# Altium schematic sheet 780-00055, rev1B, CPLD SCH, NRES RTD board.SchDoc
size B; PageSetup: Record=PageOptions|CenterHorizontal=True|CenterVertical=True|PrintScale=1.09|XCorrection=1.00|YCorrection=1.00|PrintKind=0|BorderSize=5000000|LeftOffset=0|BottomOffset=0|Orientation=2|PaperLength=1000|PaperWidth=1000|Scale=100|PaperSource=7|PrintQuality=-4|MediaType=1|DitherType=10|PaperKind=Ledger|PrintScaleMode=1
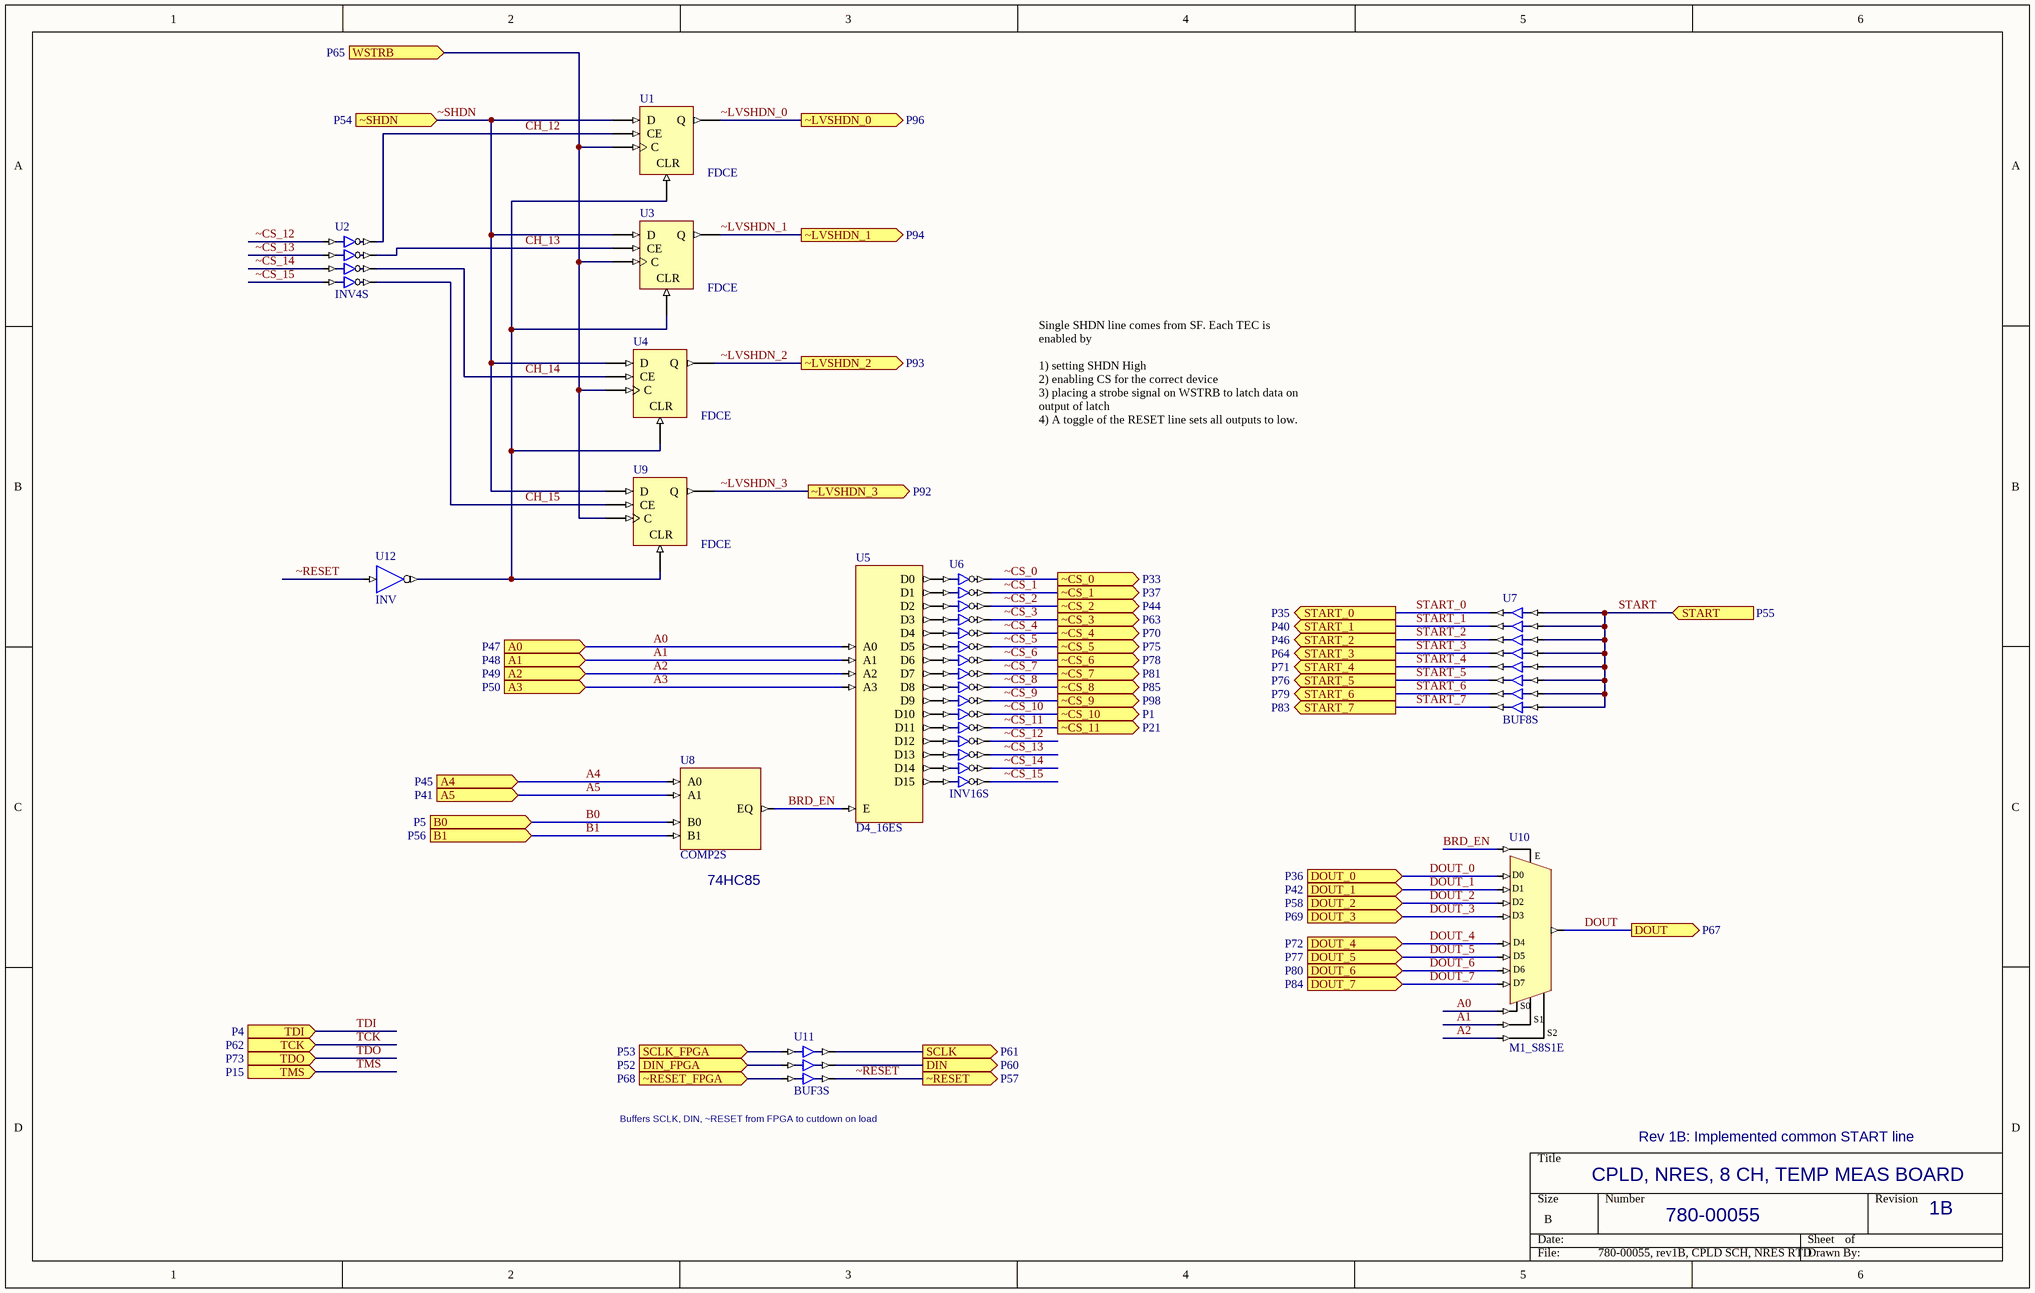
[diagram p0: 780-00055, rev1B, CPLD SCH, NRES RTD board.SchDoc]

## Parts
U1  FDCE
U2  INV4S
U3  FDCE
U4  FDCE
U5  D4_16ES
U6  INV16S
U7  BUF8S
U8  COMP2S
U9  FDCE
U10  M1_S8S1E
U11  BUF3S
U12  INV

## Ports
A0 (in, see P47), A1 (in, see P48), A2 (in, see P49), A3 (in, see P50), A4 (in, see P45), A5 (in, see P41), B0 (in, see P5), B1 (in, see P56), DIN (out, see P60), DIN_FPGA (in, see P52), DOUT (out, see P67), DOUT_0 (in, see P36), DOUT_1 (in, see P42), DOUT_2 (in, see P58), DOUT_3 (in, see P69), DOUT_4 (in, see P72), DOUT_5 (in, see P77), DOUT_6 (in, see P80), DOUT_7 (in, see P84), SCLK (out, see P61), SCLK_FPGA (in, see P53), START (in, see P55), START_0 (out, see P35), START_1 (out, see P40), START_2 (out, see P46), START_3 (out, see P64), START_4 (out, see P71), START_5 (out, see P76), START_6 (out, see P79), START_7 (out, see P83), TCK (in, see P62), TDI (in, see P4), TDO (in, see P73), TMS (in, see P15), WSTRB (in, see P65), ~CS_0 (out, see P33), ~CS_1 (out, see P37), ~CS_2 (out, see P44), ~CS_3 (out, see P63), ~CS_4 (out, see P70), ~CS_5 (out, see P75), ~CS_6 (out, see P78), ~CS_7 (out, see P81), ~CS_8 (out, see P85), ~CS_9 (out, see P98), ~CS_10 (out, see P1), ~CS_11 (out, see P21), ~LVSHDN_0 (out, see P96), ~LVSHDN_1 (out, see P94), ~LVSHDN_2 (out, see P93), ~LVSHDN_3 (out, see P92), ~RESET (out, see P57), ~RESET_FPGA (in, see P68), ~SHDN (in, see P54)

## Nets
A0: U5.A0 U10.S0 ; port A0
A1: U5.A1 U10.S1 ; port A1
A2: U5.A2 U10.S2 ; port A2
A3: U5.A3 ; port A3
A4: U8.A0 ; port A4
A5: U8.A1 ; port A5
B0: U8.B0 ; port B0
B1: U8.B1 ; port B1
BRD_EN: U5.E U8.EQ U10.E
CH_12: U1.CE U2.O0
CH_13: U2.O1 U3.CE
CH_14: U2.O2 U4.CE
CH_15: U2.O3 U9.CE
DIN: U11.O1 ; port DIN
DIN_FPGA: U11.I1 ; port DIN_FPGA
DOUT: U10.O ; port DOUT
DOUT_0: U10.D0 ; port DOUT_0
DOUT_1: U10.D1 ; port DOUT_1
DOUT_2: U10.D2 ; port DOUT_2
DOUT_3: U10.D3 ; port DOUT_3
DOUT_4: U10.D4 ; port DOUT_4
DOUT_5: U10.D5 ; port DOUT_5
DOUT_6: U10.D6 ; port DOUT_6
DOUT_7: U10.D7 ; port DOUT_7
SCLK: U11.O0 ; port SCLK
SCLK_FPGA: U11.I0 ; port SCLK_FPGA
START: U7.I0 U7.I1 U7.I2 U7.I3 U7.I4 U7.I5 U7.I6 U7.I7 ; port START
START_0: U7.O7 ; port START_0
START_1: U7.O6 ; port START_1
START_2: U7.O5 ; port START_2
START_3: U7.O4 ; port START_3
START_4: U7.O3 ; port START_4
START_5: U7.O2 ; port START_5
START_6: U7.O1 ; port START_6
START_7: U7.O0 ; port START_7
TCK: port TCK
TDI: port TDI
TDO: port TDO
TMS: port TMS
WSTRB: U1.C U3.C U4.C U9.C ; port WSTRB
~CS_0: U6.O0 ; port ~CS_0
~CS_1: U6.O1 ; port ~CS_1
~CS_2: U6.O2 ; port ~CS_2
~CS_3: U6.O3 ; port ~CS_3
~CS_4: U6.O4 ; port ~CS_4
~CS_5: U6.O5 ; port ~CS_5
~CS_6: U6.O6 ; port ~CS_6
~CS_7: U6.O7 ; port ~CS_7
~CS_8: U6.O8 ; port ~CS_8
~CS_9: U6.O9 ; port ~CS_9
~CS_10: U6.O10 ; port ~CS_10
~CS_11: U6.O11 ; port ~CS_11
~CS_12: U2.I0 U6.O12
~CS_13: U2.I1 U6.O13
~CS_14: U2.I2 U6.O14
~CS_15: U2.I3 U6.O15
~LVSHDN_0: U1.Q ; port ~LVSHDN_0
~LVSHDN_1: U3.Q ; port ~LVSHDN_1
~LVSHDN_2: U4.Q ; port ~LVSHDN_2
~LVSHDN_3: U9.Q ; port ~LVSHDN_3
~RESET: U11.O2 U12.I ; port ~RESET
~RESET_FPGA: U11.I2 ; port ~RESET_FPGA
~SHDN: U1.D U3.D U4.D U9.D ; port ~SHDN
NetU1_CLR: U1.CLR U3.CLR U4.CLR U9.CLR U12.O
NetU5_D0: U5.D0 U6.I0
NetU5_D1: U5.D1 U6.I1
NetU5_D2: U5.D2 U6.I2
NetU5_D3: U5.D3 U6.I3
NetU5_D4: U5.D4 U6.I4
NetU5_D5: U5.D5 U6.I5
NetU5_D6: U5.D6 U6.I6
NetU5_D7: U5.D7 U6.I7
NetU5_D8: U5.D8 U6.I8
NetU5_D9: U5.D9 U6.I9
NetU5_D10: U5.D10 U6.I10
NetU5_D11: U5.D11 U6.I11
NetU5_D12: U5.D12 U6.I12
NetU5_D13: U5.D13 U6.I13
NetU5_D14: U5.D14 U6.I14
NetU5_D15: U5.D15 U6.I15

## Notes on the sheet
- Single SHDN line comes from SF. Each TEC is enabled by
  1) setting SHDN High
  2) enabling CS for the correct device
  3) placing a strobe signal on WSTRB to latch data on output of latch
  4) A toggle of the RESET line sets all outputs to low.
- (near U8) 74HC85
- (near U11) Buffers SCLK, DIN, ~RESET from FPGA to cutdown on load
- CPLD, NRES, 8 CH, TEMP MEAS BOARD
- Rev 1B: Implemented common START line
- 780-00055
- 1B

## Library data of the parts
U1 U3 U4 U9 = FDCE: D Flip-Flop with Clock Enable and Asynchronous Clear; FPGAVendor: Xilinx; Published: 15-Sep-2003; Publisher: Altium Limited; HelpURL: http://toolbox.xilinx.com/docsan/xilinx7/books/docs/lib/lib.pdf
U2 = INV4S: 4-Bit Inverter, Single Pin Version; XilinxEquivalent: INV4; FunctionalClass: Logic Primitive; SubClass: INV; PortSize: 4; ArchiveName: GENERIC; VHDLIB_SIM: GENERIC_LIB; Published: 29-Jan-2004; Publisher: Altium Limited; LastRevisionNo: 1.00.00; HelpURL: CR0118 FPGA Generic Library Guide.pdf#page=291; ComponentLink1URL: CR0136 FPGA Logic Primitive Resource Usage.pdf#page=67; ComponentLink1Description: Core &Resource Usage; PortStyle: Single Pin Version
U5 = D4_16ES: Binary 4- to 16-Bit Decoder with Enable, Single Pin Version; XilinxEquivalent: D4_16E; SubClass: n_m; Enable: High; PortSize: 16; ArchiveName: GENERIC; VHDLIB_SIM: GENERIC_LIB; Published: 29-Jan-2004; Publisher: Altium Limited; LastRevisionNo: 1.00.00; HelpURL: CR0118 FPGA Generic Library Guide.pdf#page=159; ComponentLink1URL: CR0131 FPGA Decoder Resource Usage.pdf#page=16; ComponentLink1Description: Core &Resource Usage; FunctionalClass: Decoder; PortStyle: Single Pin Version
U6 = INV16S: 16-Bit Inverter, Single Pin Version; FunctionalClass: Logic Primitive; SubClass: INV; PortSize: 16; ArchiveName: GENERIC; VHDLIB_SIM: GENERIC_LIB; Published: 29-Jan-2004; Publisher: Altium Limited; LastRevisionNo: 1.00.00; HelpURL: CR0118 FPGA Generic Library Guide.pdf#page=291; ComponentLink1URL: CR0136 FPGA Logic Primitive Resource Usage.pdf#page=83; ComponentLink1Description: Core &Resource Usage; PortStyle: Single Pin Version
U7 = BUF8S: 8-Bit General Purpose (Non-inverting) Buffer, Single Pin Version; SubClass: BUF; PortSize: 8; ArchiveName: GENERIC; VHDLIB_SIM: GENERIC_LIB; Published: 29-Jan-2004; Publisher: Altium Limited; LastRevisionNo: 1.00.00; HelpURL: CR0118 FPGA Generic Library Guide.pdf#page=122; ComponentLink1URL: CR0125 FPGA Buffer Resource Usage.pdf#page=17; ComponentLink1Description: Core &Resource Usage; FunctionalClass: Buffer; PortStyle: Single Pin Version
U8 = COMP2S: 2-Bit Identity Comparator, Single Pin Version; XilinxEquivalent: COMP2; SubClass: COMP; PortSize: 2; ArchiveName: GENERIC; VHDLIB_SIM: GENERIC_LIB; Published: 29-Jan-2004; Publisher: Altium Limited; LastRevisionNo: 1.00.00; HelpURL: CR0118 FPGA Generic Library Guide.pdf#page=151; ComponentLink1URL: CR0129 FPGA Comparator Resource Usage.pdf#page=3; ComponentLink1Description: Core &Resource Usage; FunctionalClass: Comparator; PortStyle: Single Pin Version
U10 = M1_S8S1E: 8x1-Single Wire to 1x1-Single Wire Multiplexer With Enable; XilinxEquivalent: M8_1E; SubClass: SnS1; Enable: High; PortSize: 1; PortStyle: Single Pin Version; ArchiveName: GENERIC; VHDLIB_SIM: GENERIC_LIB; Published: 29-Jan-2004; Publisher: Altium Limited; LastRevisionNo: 1.00.00; HelpURL: CR0118 FPGA Generic Library Guide.pdf#page=383; ComponentLink1URL: CR0137 FPGA Multiplexer Resource Usage.pdf#page=58; ComponentLink1Description: Core &Resource Usage; FunctionalClass: Multiplexer
U11 = BUF3S: 3-Bit General Purpose (Non-inverting) Buffer, Single Pin Version; SubClass: BUF; PortSize: 3; ArchiveName: GENERIC; VHDLIB_SIM: GENERIC_LIB; Published: 29-Jan-2004; Publisher: Altium Limited; LastRevisionNo: 1.00.00; HelpURL: CR0118 FPGA Generic Library Guide.pdf#page=122; ComponentLink1URL: CR0125 FPGA Buffer Resource Usage.pdf#page=7; ComponentLink1Description: Core &Resource Usage; FunctionalClass: Buffer; PortStyle: Single Pin Version
U12 = INV: Inverter; FunctionalClass: Logic Primitive; ArchiveName: GENERIC; VHDLIB_SIM: GENERIC_LIB; Published: 29-Jan-2004; Publisher: Altium Limited; XilinxEquivalent: INV; LastRevisionNo: 1.00.00; HelpURL: CR0118 FPGA Generic Library Guide.pdf#page=291; ComponentLink1URL: CR0136 FPGA Logic Primitive Resource Usage.pdf#page=61; ComponentLink1Description: Core &Resource Usage; SubClass: INV